# Altium project Base_Block.PrjPcb
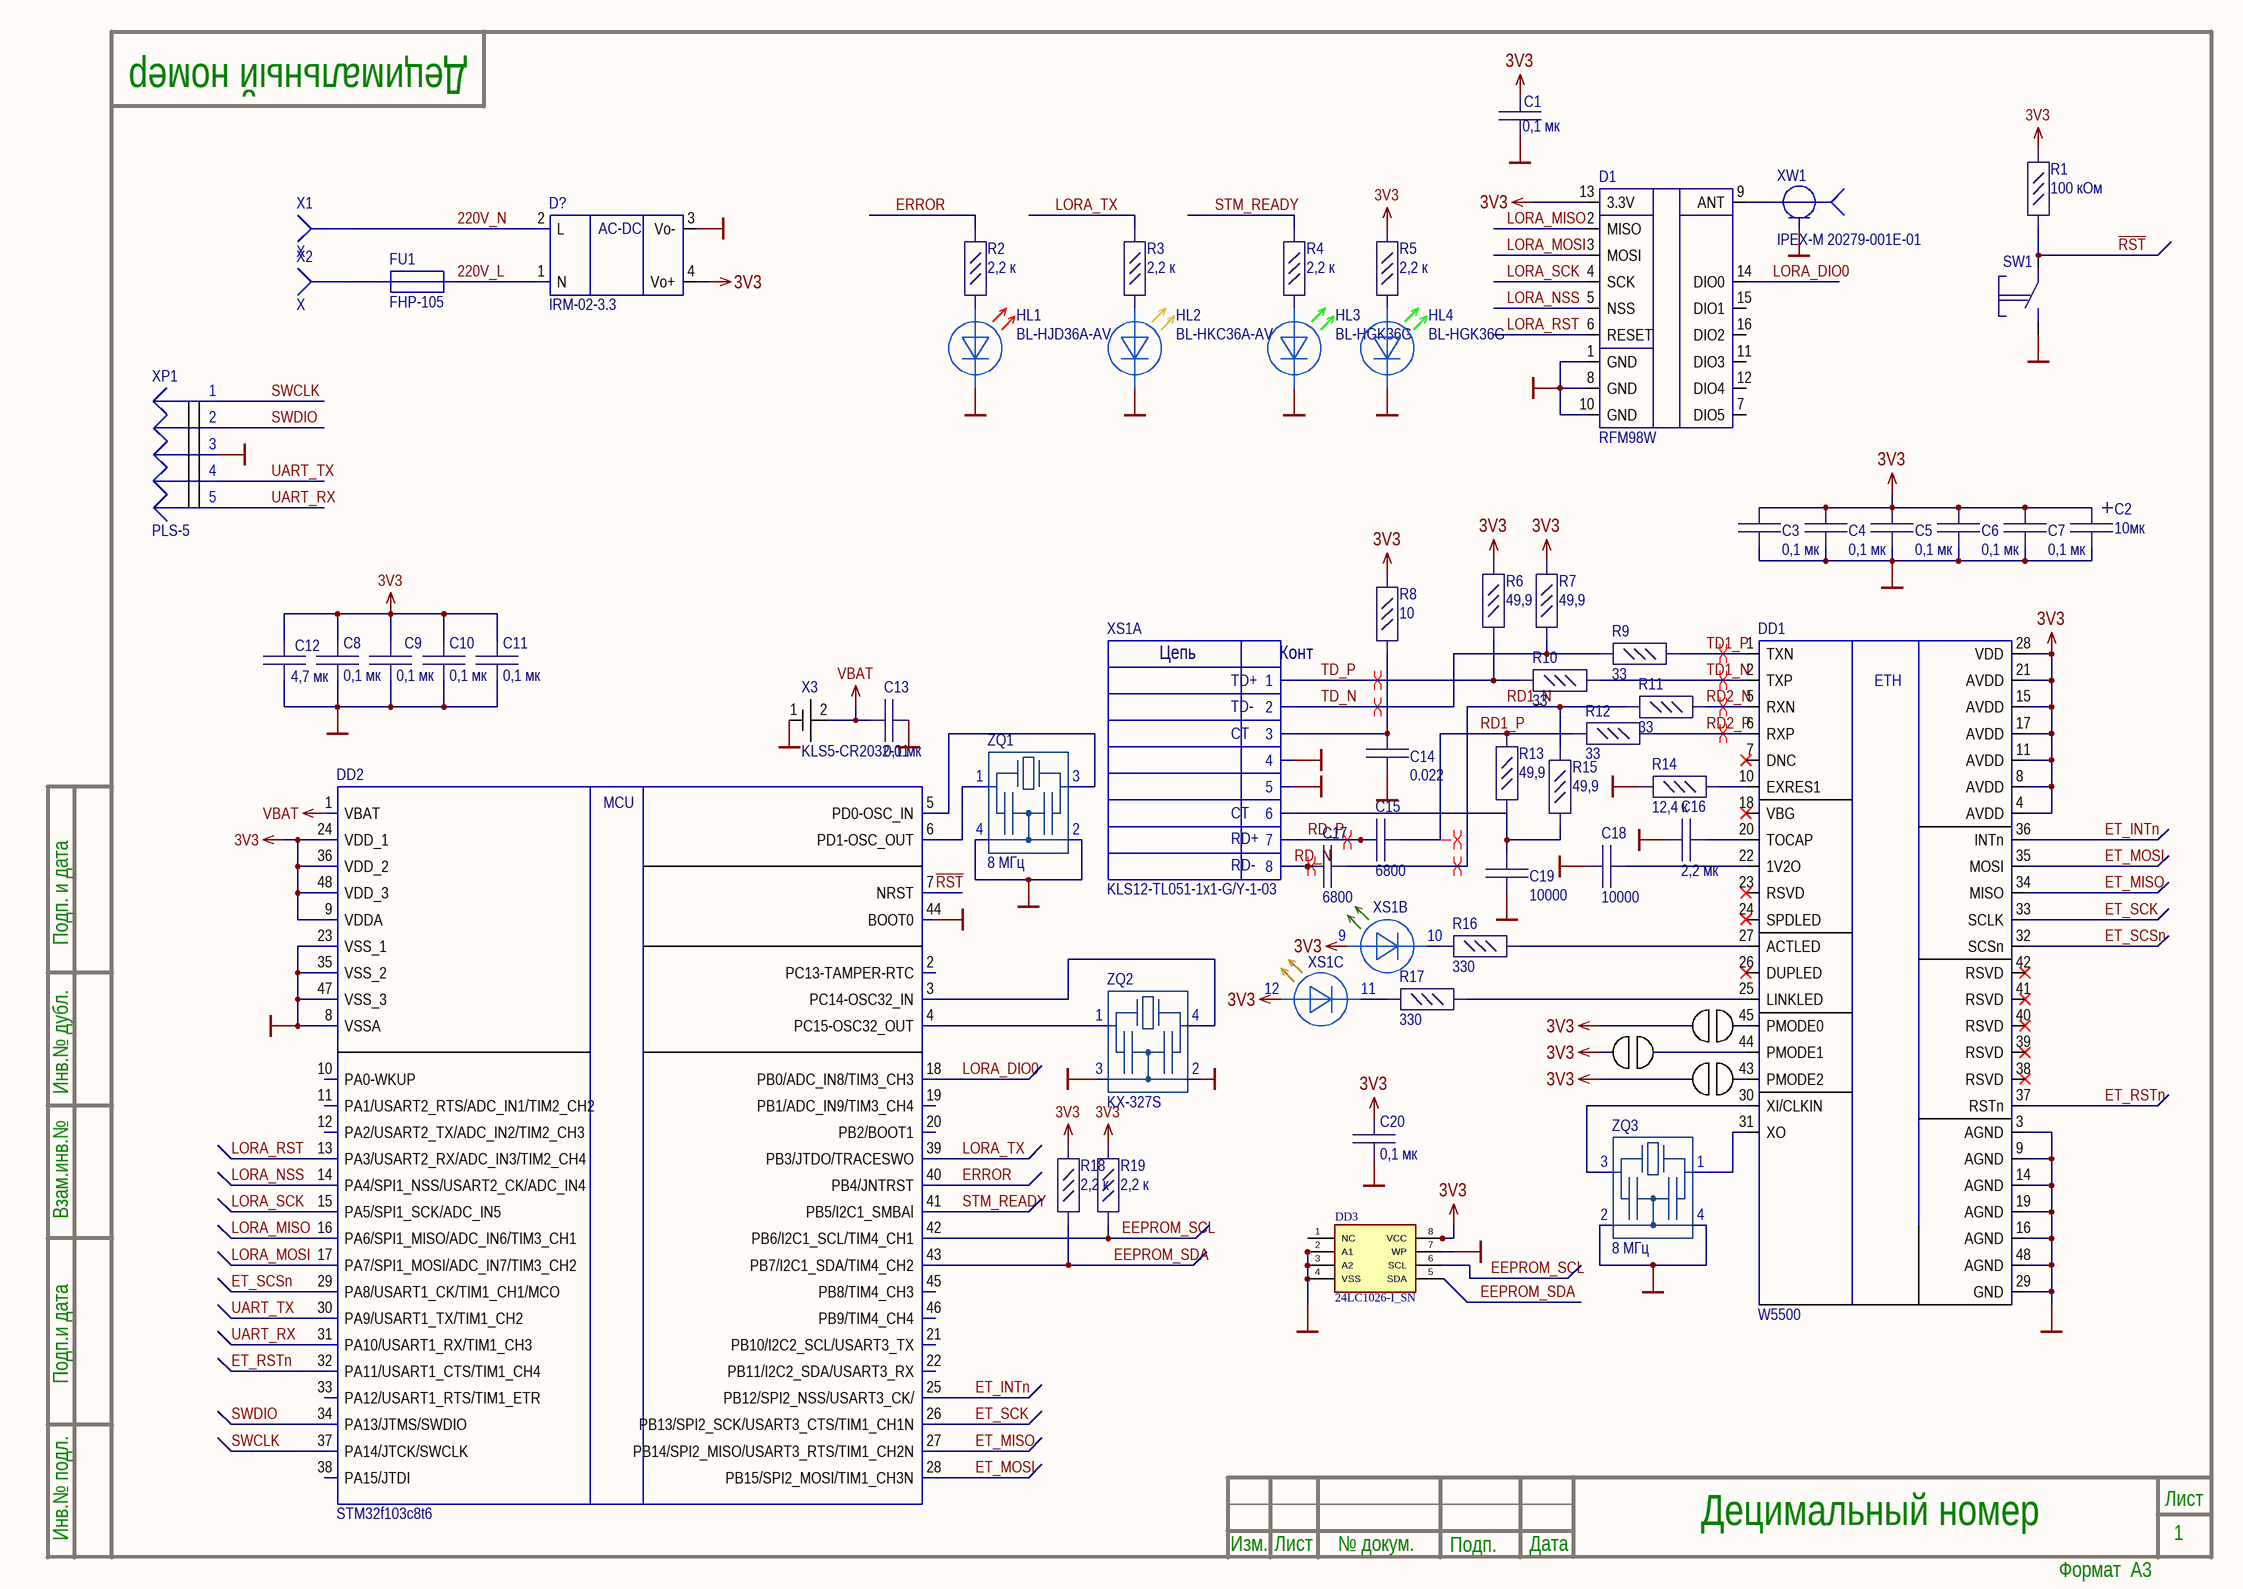
[diagram p0: Sheet2.SchDoc]
1 sheet, 62 parts. Net scope: global (net labels, ports and power ports of the same name join across sheets).
Board file: PCB1.PcbDoc

## Sheet Sheet2.SchDoc: Наименование
size 420 x 297 mm; ApprovedBy: Утвердил; CheckedBy: Проверил; Author: Разработал; CompanyName: Организация; DrawnBy: Н.Контр; Engineer: Т.Контр; SheetNumber: 1; SheetTotal: 1; PageSetup: Record=PageOptions|CenterHorizontal=True|CenterVertical=True|PrintScale=0.94|XCorrection=1.00|YCorrection=1.00|PrintKind=1|BorderSize=5000000|LeftOffset=0|BottomOffset=0|Orientation=1|PaperLength=1000|PaperWidth=1000|Scale=100|PaperSource=7|PrintQuality=-4|MediaType=1|DitherType=10|PaperKind=A4|PrintScaleMode=1; DecimalNumber: Децимальный номер; HeadOfSector: Нач. сектора; MainDevice: Перв.примен.; Name: Наименование; DocumentName: Sheet1.SCHDOC

### Parts
C1  0,1 мк  [C_0603]
C2  10мк  [D_CASE]
C3  0,1 мк  [C_0603]
C4  0,1 мк  [C_0603]
C5  0,1 мк  [C_0603]
C6  0,1 мк  [C_0603]
C7  0,1 мк  [C_0603]
C8  0,1 мк  [C_0603]
C9  0,1 мк  [C_0603]
C10  0,1 мк  [C_0603]
C11  0,1 мк  [C_0603]
C12  4,7 мк  [C_0603]
C13  0,1 мк  [C_0603]
C14  0.022  [C_0603]
C15  6800  [C_0603]
C16  2,2 мк  [C_0603]
C17  6800  [C_0603]
C18  10000  [C_0603]
C19  10000  [C_0603]
C20  0,1 мк  [C_0603]
D1  RFM98W  [RFM98W]
D?  IRM-02-3.3  [IRM-02]
DD1  W5500  [LQFP48]
DD2  STM32f103c8t6  [LQFP48]
DD3  24LC1026-I_SN  [SOIC127P600X175-8N]
FU1  FHP-105  [FHP-105]
HL1  BL-HJD36A-AV  [LED_0603_RED]
HL2  BL-HKC36A-AV  [LED_0603_GREEN]
HL3  BL-HGK36G  [LED_0603_GREEN]
HL4  BL-HGK36G  [LED_0603_GREEN]
R1  100 кОм  [R_0603]
R2  2,2 к  [R_0603]
R3  2,2 к  [R_0603]
R4  2,2 к  [R_0603]
R5  2,2 к  [R_0603]
R6  49,9  [R_0603]
R7  49,9  [R_0603]
R8  10  [R_0603]
R9  33  [R_0603]
R10  33  [R_0603]
R11  33  [R_0603]
R12  33  [R_0603]
R13  49,9  [R_0603]
R14  12,4 к  [R_0603]
R15  49,9  [R_0603]
R16  330  [R_0603]
R17  330  [R_0603]
R18  2,2 к  [R_0603]
R19  2,2 к  [R_0603]
SW1  7914G-1-000E  [7914G]  (value not drawn)
X1  X  [TH_Сontact]
X2  X  [TH_Сontact]
X3  KLS5-CR2032-01  [KLS5-CR2032-01]
X4  Solder_jumper  [Solder_jumper]  (value not drawn)
X5  Solder_jumper  [Solder_jumper]  (value not drawn)
X6  Solder_jumper  [Solder_jumper]  (value not drawn)
XP1  PLS-5  [PLS-5]
XS1  KLS12-TL051-1x1-G/Y-1-03  [KLS12-TL051]  (parts A,B,C of 3)
XW1  IPEX-M 20279-001E-01  [IPEX]
ZQ1  8 МГц  [MJ CRYSTAL]
ZQ2  KX-327S  [KX-327S]
ZQ3  8 МГц  [MJ CRYSTAL]

### Nets
3V3: C1.2 C2.1 C3.2 C4.2 C5.2 C6.2 C7.2 C8.2 C9.2 C10.2 C11.2 C12.2 C20.2 D1.13(3.3V) D?.4(Vo+) DD1.4(AVDD) DD1.8(AVDD) DD1.11(AVDD) DD1.15(AVDD) DD1.17(AVDD) DD1.21(AVDD) DD1.28(VDD) DD2.9(VDDA) DD2.24(VDD_1) DD2.36(VDD_2) DD2.48(VDD_3) DD3.8(VCC) R1.2 R5.2 R6.2 R7.2 R8.2 R18.2 R19.2 X4.1 X5.1 X6.1 XS1.9 XS1.12
GND: C1.1 C2.2 C3.1 C4.1 C5.1 C6.1 C7.1 C8.1 C9.1 C10.1 C11.1 C12.1 C13.1 C14.1 C16.2 C18.1 C19.1 C20.1 D1.1(GND) D1.8(GND) D1.10(GND) D?.3(Vo-) DD1.3(AGND) DD1.9(AGND) DD1.14(AGND) DD1.16(AGND) DD1.19(AGND) DD1.29(GND) DD1.48(AGND) DD2.8(VSSA) DD2.23(VSS_1) DD2.35(VSS_2) DD2.44(BOOT0) DD2.47(VSS_3) DD3.2(A1) DD3.3(A2) DD3.4(VSS) DD3.7(WP) HL1.2 HL2.2 HL3.2 HL4.2 R14.1 SW1.1 X3.1 XP1.3 XS1.4 XS1.5 XW1.1 ZQ1.2 ZQ1.4 ZQ2.2 ZQ2.3 ZQ3.2 ZQ3.4
VBAT: C13.2 DD2.1(VBAT) X3.2
220V_L: D?.1(N) FU1.2
220V_N: D?.2(L) X1.1
EEPROM_SCL: DD2.42(PB6/I2C1_SCL/TIM4_CH1) DD3.6(SCL) R19.1
EEPROM_SDA: DD2.43(PB7/I2C1_SDA/TIM4_CH2) DD3.5(SDA) R18.1
ERROR: DD2.40(PB4/JNTRST) R2.2
ET_INTn: DD1.36(INTn) DD2.25(PB12/SPI2_NSS/USART3_CK/)
ET_MISO: DD1.34(MISO) DD2.27(PB14/SPI2_MISO/USART3_RTS/TIM1_CH2N)
ET_MOSI: DD1.35(MOSI) DD2.28(PB15/SPI2_MOSI/TIM1_CH3N)
ET_RSTn: DD1.37(RSTn) DD2.32(PA11/USART1_CTS/TIM1_CH4)
ET_SCK: DD1.33(SCLK) DD2.26(PB13/SPI2_SCK/USART3_CTS/TIM1_CH1N)
ET_SCSn: DD1.32(SCSn) DD2.29(PA8/USART1_CK/TIM1_CH1/MCO)
LORA_DIO0: D1.14(DIO0) DD2.18(PB0/ADC_IN8/TIM3_CH3)
LORA_MISO: D1.2(MISO) DD2.16(PA6/SPI1_MISO/ADC_IN6/TIM3_CH1)
LORA_MOSI: D1.3(MOSI) DD2.17(PA7/SPI1_MOSI/ADC_IN7/TIM3_CH2)
LORA_NSS: D1.5(NSS) DD2.14(PA4/SPI1_NSS/USART2_CK/ADC_IN4)
LORA_RST: D1.6(RESET) DD2.13(PA3/USART2_RX/ADC_IN3/TIM2_CH4)
LORA_SCK: D1.4(SCK) DD2.15(PA5/SPI1_SCK/ADC_IN5)
LORA_TX: DD2.39(PB3/JTDO/TRACESWO) R3.2
~{RST}: DD2.7(NRST) R1.1 SW1.2
RD1_N: C17.2 R11.1 R15.2
RD1_P: C15.2 R12.1 R13.2
RD2_N: DD1.5(RXN) R11.2
RD2_P: DD1.6(RXP) R12.2
RD_N: C17.1 XS1.8
RD_P: C15.1 XS1.7
STM_READY: DD2.41(PB5/I2C1_SMBAl) R4.2
SWCLK: DD2.37(PA14/JTCK/SWCLK) XP1.1
SWDIO: DD2.34(PA13/JTMS/SWDIO) XP1.2
TD1_N: DD1.2(TXP) R10.2
TD1_P: DD1.1(TXN) R9.2
TD_N: R7.1 R9.1 XS1.2
TD_P: R6.1 R10.1 XS1.1
UART_RX: DD2.31(PA10/USART1_RX/TIM1_CH3) XP1.5
UART_TX: DD2.30(PA9/USART1_TX/TIM1_CH2) XP1.4
NetC14_2: C14.2 R8.1 XS1.3
NetC16_1: C16.1 DD1.20(TOCAP)
NetC18_2: C18.2 DD1.22(1V2O)
NetC19_2: C19.2 R13.1 R15.1 XS1.6
NetD1_9: D1.9(ANT) XW1.2
NetDD1_10: DD1.10(EXRES1) R14.2
NetDD1_25: DD1.25(LINKLED) R17.2
NetDD1_27: DD1.27(ACTLED) R16.2
NetDD1_30: DD1.30(XI/CLKIN) ZQ3.3
NetDD1_31: DD1.31(XO) ZQ3.1
NetDD1_43: DD1.43(PMODE2) X6.2
NetDD1_44: DD1.44(PMODE1) X5.2
NetDD1_45: DD1.45(PMODE0) X4.2
NetDD2_3: DD2.3(PC14-OSC32_IN) ZQ2.4
NetDD2_4: DD2.4(PC15-OSC32_OUT) ZQ2.1
NetDD2_5: DD2.5(PD0-OSC_IN) ZQ1.3
NetDD2_6: DD2.6(PD1-OSC_OUT) ZQ1.1
NetFU1_1: FU1.1 X2.1
NetHL1_1: HL1.1 R2.1
NetHL2_1: HL2.1 R3.1
NetHL3_1: HL3.1 R4.1
NetHL4_1: HL4.1 R5.1
NetR16_1: R16.1 XS1.10
NetR17_1: R17.1 XS1.11

Not connected (* = marked no-connect by the designer): D1 7(DIO5) 11(DIO3) 12(DIO4) 15(DIO1) 16(DIO2); DD1 7(DNC)* 18(VBG)* 23(RSVD)* 24(SPDLED)* 26(DUPLED)* 38(RSVD)* 39(RSVD)* 40(RSVD)* 41(RSVD)* 42(RSVD)*; DD2 2(PC13-TAMPER-RTC) 10(PA0-WKUP) 11(PA1/USART2_RTS/ADC_IN1/TIM2_CH2) 12(PA2/USART2_TX/ADC_IN2/TIM2_CH3) 19(PB1/ADC_IN9/TIM3_CH4) 20(PB2/BOOT1) 21(PB10/I2C2_SCL/USART3_TX) 22(PB11/I2C2_SDA/USART3_RX) 33(PA12/USART1_RTS/TIM1_ETR) 38(PA15/JTDI) 45(PB8/TIM4_CH3) 46(PB9/TIM4_CH4); DD3 1(NC)

### Layout directives
differential pair: RD1_N, RD1_P, RD2_N, RD2_P, RD_N, RD_P, TD1_N, TD1_P, TD_N, TD_P

### Notes on the sheet
- Подп. и дата
- Инв.№ дубл.
- Взам.инв.№
- Подп.и дата
- Инв.№ подл.
- Изм.
- Лист
- № докум.
- Подп.
- Дата
- Формат  A3
- (in symbol IRM-02-3.3) AC-DC
- (in symbol KLS12-TL051-1x1-G/Y-1-03, part A) Цепь; Конт; TD+; TD-; CT; RD+; RD-
- (in symbol STM32f103c8t6) MCU
- (in symbol W5500) ETH

### Library data of the parts
C1 C8-C11 C13 C20 = GRM188R72A104MA35D: CAP CER 0.1UF 100V X7R 0603; Manufacturer: Murata Electronics; Value: 0.1µF; Part Number: GRM188R72A104MA35D; ComponentLink1URL: https://search.murata.co.jp/Ceramy/image/img/A01X/G101/ENG/GRM188R72A104MA35-01.pdf; ComponentLink1Description: Datasheet; Component Type: Capasitor
C2 = T491D106K035AT: CAP TANT 10UF 10% 35V 2917; Manufacturer: KEMET; Value: 10µF; Part Number: T491D106K035AT; ComponentLink1URL: https://api.kemet.com/component-edge/download/datasheet/T491D106K035AT.pdf; ComponentLink1Description: Datasheet; Component Type: Tantalum Capacitor
C3-C7 = GRM188R72A104KA35D: CAP CER 0.1UF 100V X7R 0603; Manufacturer: Murata Electronics; Value: 0.1µF; Part Number: GRM188R72A104KA35D; ComponentLink1URL: https://www.murata.com/~/media/webrenewal/support/library/catalog/products/capacitor/mlcc/c02e.ashx?la=en-us; ComponentLink1Description: Datasheet; Component Type: Capasitor
C12 = GRM188R61C475KE11D: CAP CER 4.7UF 16V X5R 0603; Manufacturer: Murata Electronics; Value: 4.7µF; Part Number: GRM188R61C475KE11D; ComponentLink1URL: https://search.murata.co.jp/Ceramy/image/img/A01X/G101/ENG/GRM188R61C475KE11-01.pdf; ComponentLink1Description: Datasheet; Component Type: Capasitor
C14 C18 C19 = GRM1885C1H103JA01D: CAP CER 10000PF 50V C0G/NP0 0603; Manufacturer: Murata Electronics; Part Number: GRM1885C1H103JA01D; Value: 10000pF; ComponentLink1URL: https://www.murata.com/~/media/webrenewal/support/library/catalog/products/capacitor/mlcc/c02e.ashx?la=en-us; ComponentLink1Description: Datasheet; Component Type: Capasitor
C15 C17 = GRM1885C1H682JA01D: CAP CER 6800PF 50V C0G/NP0 0603; Manufacturer: Murata Electronics; Part Number: GRM1885C1H682JA01D; Value: 6800pF; ComponentLink1URL: https://www.murata.com/~/media/webrenewal/support/library/catalog/products/capacitor/mlcc/c02e.ashx?la=en-us; ComponentLink1Description: Datasheet; Component Type: Capasitor
C16 = GRM188R71A225ME15D: CAP CER 2.2UF 10V X7R 0603; Manufacturer: Murata Electronics; Value: 2.2µF; Part Number: GRM188R71A225ME15D; ComponentLink1URL: https://www.murata.com/~/media/webrenewal/support/library/catalog/products/capacitor/mlcc/c02e.ashx?la=en-us; ComponentLink1Description: Datasheet; Component Type: Capasitor
D1 = RFM98W: LoRa modem
D? = IRM-02-3.3: АС-DC преобразователь
DD1 = W5500: Hardwired TCP/IP embedded Ethernet controller
DD3 = 24LC1026-I_SN: Integrated Circuit; Manufacturer_Name: Microchip; Manufacturer_Part_Number: 24LC1026-I/SN; Datasheet Link: https://componentsearchengine.com/Datasheets/2/24LC1026-I_SN.pdf; Height: 1.75mm; Mouser Part Number: 579-24LC1026-I/SN; Mouser Price/Stock: https://www.mouser.co.uk/ProductDetail/Microchip-Technology/24LC1026-I-SN?qs=uHi2%2FQoPa5AHb5C3N5zZbQ%3D%3D; Arrow Part Number: 24LC1026-I/SN; Arrow Price/Stock: https://www.arrow.com/en/products/24lc1026-isn/microchip-technology
HL1 = BL-HJD36A-AV: SMD LED 0603 TOP красный
HL2 = BL-HKC36A-AV: SMD LED 0603 TOP желтый
HL3 HL4 = BL-HGK36G: SMD LED 0603 TOP зеленый
R1 = CR0603-FX-1003ELF: RES SMD 100K OHM 1% 1/10W 0603; Manufacturer: Bourns Inc.; Part Number: CR0603-FX-1003ELF; Value: 100 кОм; ComponentLink1URL: https://www.bourns.com/pdfs/chpreztr.pdf; ComponentLink1Description: Datasheet; Component Type: Resistor
R2-R5 R18 R19 = CR0603-FX-2201ELF: RES SMD 2.2K OHM 1% 1/10W 0603; Manufacturer: Bourns Inc.; Part Number: CR0603-FX-2201ELF; Value: 2,2 к; ComponentLink1URL: https://www.bourns.com/pdfs/chpreztr.pdf; ComponentLink1Description: Datasheet; Component Type: Resistor
R6 R7 R13 R15 = CR0603-FX-49R9ELF: RES SMD 49.9 OHM 1% 1/10W 0603; Manufacturer: Bourns Inc.; Part Number: CR0603-FX-49R9ELF; Value: 49,9; ComponentLink1URL: https://www.bourns.com/pdfs/chpreztr.pdf; ComponentLink1Description: Datasheet; Component Type: Resistor
R8 = CR0603-FX-10R0ELF: RES SMD 10 OHM 1% 1/10W 0603; Manufacturer: Bourns Inc.; Part Number: CR0603-FX-10R0ELF; Value: 10; ComponentLink1URL: https://www.bourns.com/pdfs/chpreztr.pdf; ComponentLink1Description: Datasheet; Component Type: Resistor
R9-R12 = CR0603-FX-33R0ELF: RES SMD 33 OHM 1% 1/10W 0603; Manufacturer: Bourns Inc.; Part Number: CR0603-FX-33R0ELF; Value: 33; ComponentLink1URL: https://www.bourns.com/pdfs/chpreztr.pdf; ComponentLink1Description: Datasheet; Component Type: Resistor
R14 = CR0603-FX-1242ELF: RES SMD 12.4K OHM 1% 1/10W 0603; Manufacturer: Bourns Inc.; Part Number: CR0603-FX-1242ELF; Value: 12,4 к; ComponentLink1URL: https://www.bourns.com/pdfs/chpreztr.pdf; ComponentLink1Description: Datasheet; Component Type: Resistor
R16 R17 = CR0603-FX-3300ELF: RES SMD 330 OHM 1% 1/10W 0603; Manufacturer: Bourns Inc.; Part Number: CR0603-FX-3300ELF; Value: 330; ComponentLink1URL: https://www.bourns.com/pdfs/chpreztr.pdf; ComponentLink1Description: Datasheet; Component Type: Resistor
SW1 = 7914G-1-000E: Тактовый переключатель SMD
X1 X2 = X: Контактная площадка
X3 = KLS5-CR2032-01: Батарейный отсек на 1xCR2032
XS1 = KLS12-TL051-1x1-G/Y-1-03: TJ16S-8P8C Разъем на плату 8-8 (RJ-45)
ZQ1 ZQ3 = NX5032GA-8MHz
ZQ2 = KX-327S: Кварцевый резонатор 32.768 кГц, 20 ppm